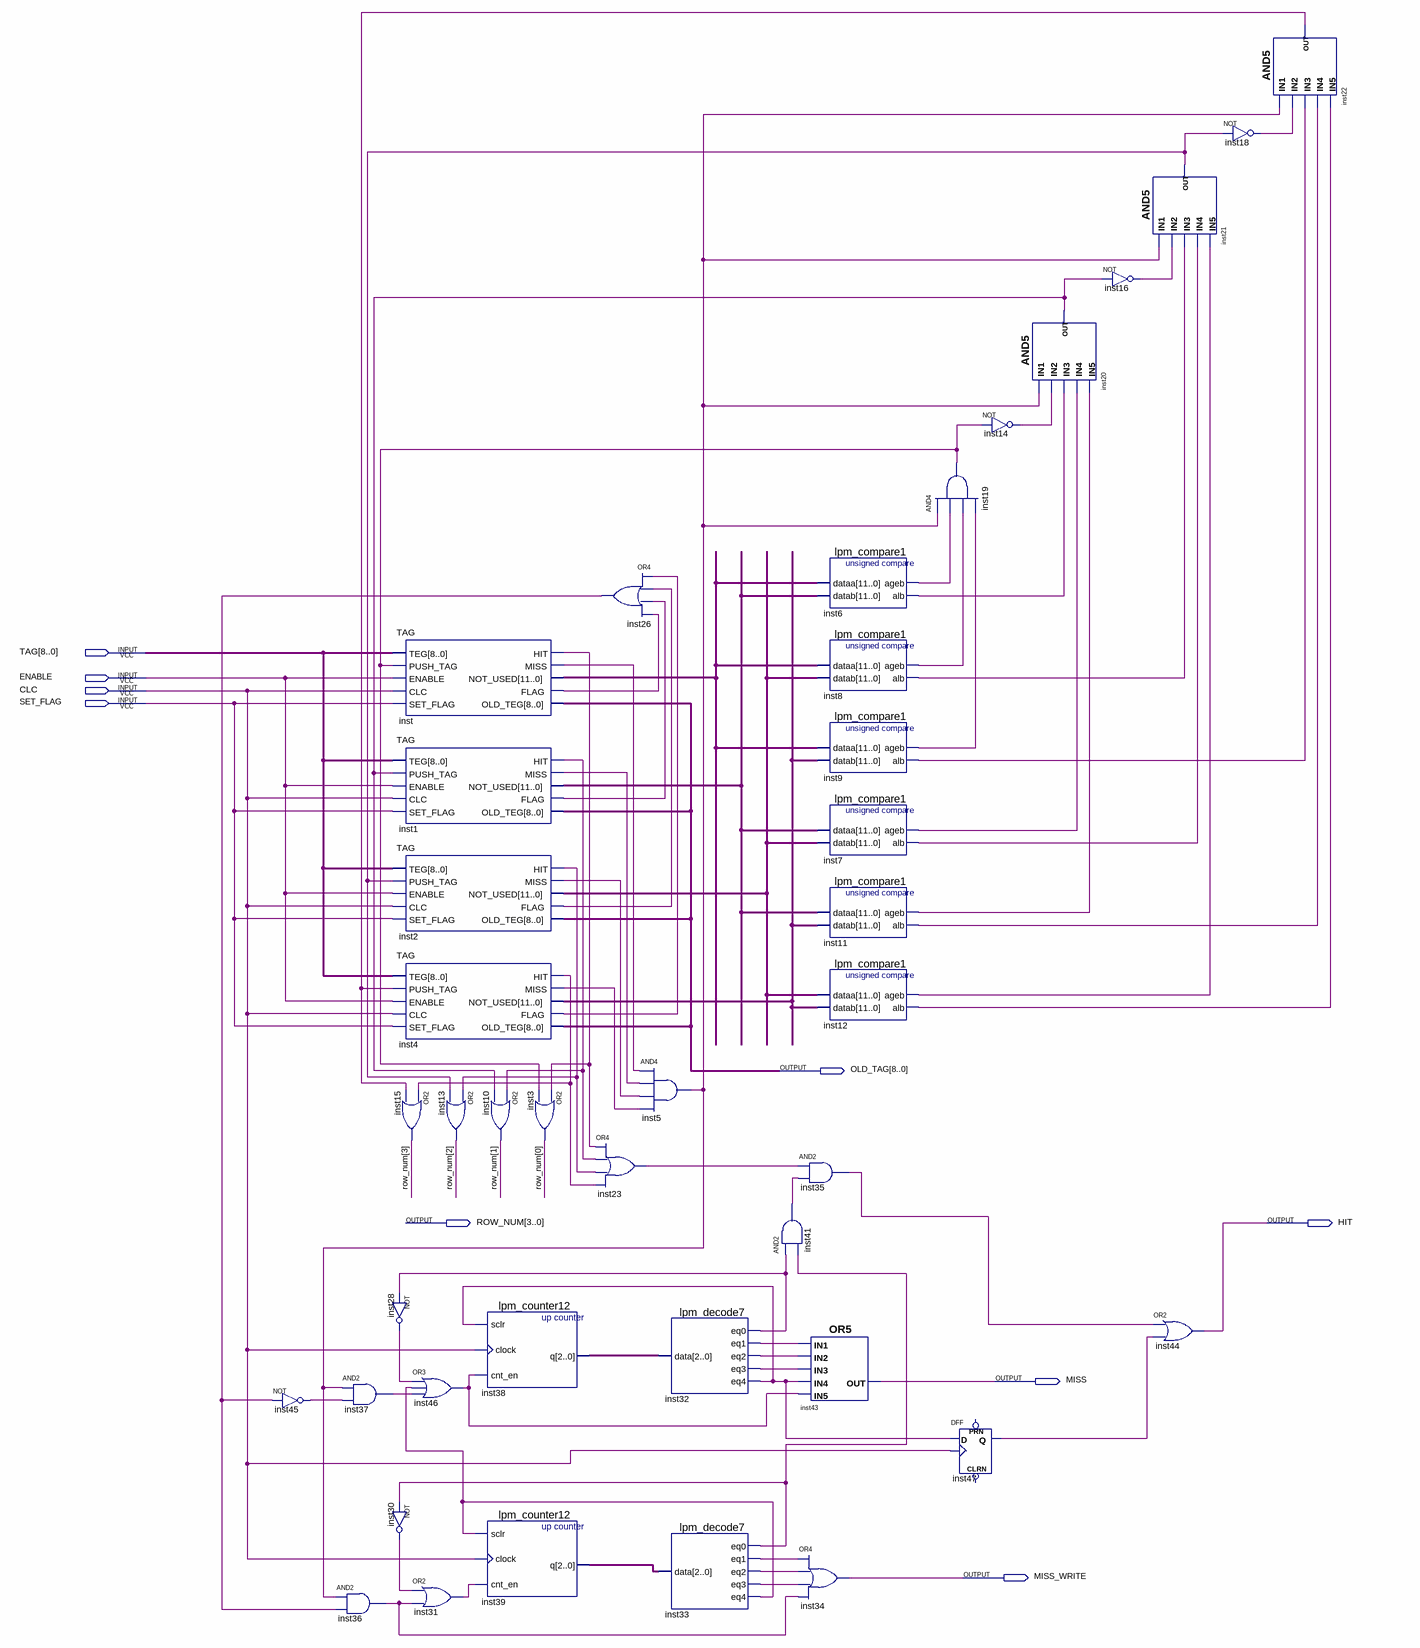
[diagram p0: schematic sheet]
// Quartus schematic TAG_MEM.bdf as structural Verilog: 41 symbols, 9 pins
module TAG_MEM (
  input  [8:0] TAG,
  input  ENABLE,
  input  CLC,
  input  SET_FLAG,
  output [8:0] OLD_TAG,
  output [3:0] ROW_NUM,
  output HIT,
  output MISS,
  output MISS_WRITE
);

  wire inst1_flag, inst1_hit, inst1_miss, inst2_flag, inst2_hit, inst2_miss, inst4_flag, inst4_hit,
       inst4_miss, inst5_out, inst6_ageb, inst6_alb, inst7_ageb, inst7_alb, inst8_ageb, inst8_alb,
       inst9_ageb, inst9_alb, inst11_ageb, inst11_alb, inst12_ageb, inst12_alb, inst14_out, inst16_out,
       inst18_out, inst19_out, inst20_out, inst21_out, inst22_out, inst23_out, inst26_out, inst28_out,
       inst30_out, inst31_out, inst32_eq0, inst32_eq1, inst32_eq2, inst32_eq3, inst32_eq4, inst33_eq0,
       inst33_eq1, inst33_eq2, inst33_eq3, inst33_eq4, inst35_out, inst36_out, inst37_out, inst41_out,
       inst45_out, inst46_out, inst47_q, inst_flag, inst_hit, inst_miss;
  wire [2:0] inst38_q, inst39_q;
  wire [11:0] inst1_not_used, inst2_not_used, inst4_not_used, inst_not_used;

  not inst45 (inst45_out, inst26_out);
  and inst37 (inst37_out, inst5_out, inst45_out);
  and inst36 (inst36_out, inst5_out, inst26_out);
  TAG inst (
    .TEG(TAG), .PUSH_TAG(inst19_out), .ENABLE(ENABLE), .CLC(CLC), .SET_FLAG(SET_FLAG), .HIT(inst_hit),
    .MISS(inst_miss), .NOT_USED(inst_not_used), .FLAG(inst_flag), .OLD_TEG(OLD_TAG));
  TAG inst1 (
    .TEG(TAG), .PUSH_TAG(inst20_out), .ENABLE(ENABLE), .CLC(CLC), .SET_FLAG(SET_FLAG), .HIT(inst1_hit),
    .MISS(inst1_miss), .NOT_USED(inst1_not_used), .FLAG(inst1_flag), .OLD_TEG(OLD_TAG));
  TAG inst2 (
    .TEG(TAG), .PUSH_TAG(inst21_out), .ENABLE(ENABLE), .CLC(CLC), .SET_FLAG(SET_FLAG), .HIT(inst2_hit),
    .MISS(inst2_miss), .NOT_USED(inst2_not_used), .FLAG(inst2_flag), .OLD_TEG(OLD_TAG));
  TAG inst4 (
    .TEG(TAG), .PUSH_TAG(inst22_out), .ENABLE(ENABLE), .CLC(CLC), .SET_FLAG(SET_FLAG), .HIT(inst4_hit),
    .MISS(inst4_miss), .NOT_USED(inst4_not_used), .FLAG(inst4_flag), .OLD_TEG(OLD_TAG));
  or inst15 (ROW_NUM[3], inst4_hit, inst22_out);
  not inst28 (inst28_out, inst32_eq0);
  not inst30 (inst30_out, inst33_eq0);
  or inst13 (ROW_NUM[2], inst2_hit, inst21_out);
  or inst46 (inst46_out, inst28_out, inst33_eq4, inst37_out);
  or inst31 (inst31_out, inst30_out, inst36_out);
  or inst10 (ROW_NUM[1], inst1_hit, inst20_out);
  lpm_counter12 inst38 (.sclr(inst32_eq4), .clock(CLC), .cnt_en(inst46_out), .q(inst38_q));
  lpm_counter12 inst39 (.sclr(inst33_eq4), .clock(CLC), .cnt_en(inst31_out), .q(inst39_q));
  or inst3 (ROW_NUM[0], inst_hit, inst19_out);
  or inst23 (inst23_out, inst_hit, inst1_hit, inst2_hit, inst4_hit);
  or inst26 (inst26_out, inst4_flag, inst2_flag, inst1_flag, inst_flag);
  and inst5 (inst5_out, inst_miss, inst1_miss, inst2_miss, inst4_miss);
  lpm_decode7 inst32 (
    .data(inst38_q), .eq0(inst32_eq0), .eq1(inst32_eq1), .eq2(inst32_eq2), .eq3(inst32_eq3), .eq4(inst32_eq4));
  lpm_decode7 inst33 (
    .data(inst39_q), .eq0(inst33_eq0), .eq1(inst33_eq1), .eq2(inst33_eq2), .eq3(inst33_eq3), .eq4(inst33_eq4));
  and inst35 (inst35_out, inst23_out, inst41_out);
  and inst41 (inst41_out, inst32_eq0, inst33_eq0);
  or inst43 (MISS, inst32_eq1, inst32_eq2, inst32_eq3, inst32_eq4, inst46_out);
  or inst34 (MISS_WRITE, inst33_eq1, inst33_eq2, inst33_eq3, inst36_out);
  lpm_compare1 inst6 (.dataa(inst_not_used), .datab(inst1_not_used), .ageb(inst6_ageb), .alb(inst6_alb));
  lpm_compare1 inst8 (.dataa(inst_not_used), .datab(inst2_not_used), .ageb(inst8_ageb), .alb(inst8_alb));
  lpm_compare1 inst9 (.dataa(inst_not_used), .datab(inst4_not_used), .ageb(inst9_ageb), .alb(inst9_alb));
  lpm_compare1 inst7 (.dataa(inst1_not_used), .datab(inst2_not_used), .ageb(inst7_ageb), .alb(inst7_alb));
  lpm_compare1 inst11 (.dataa(inst1_not_used), .datab(inst4_not_used), .ageb(inst11_ageb), .alb(inst11_alb));
  lpm_compare1 inst12 (.dataa(inst2_not_used), .datab(inst4_not_used), .ageb(inst12_ageb), .alb(inst12_alb));
  and inst19 (inst19_out, inst5_out, inst6_ageb, inst8_ageb, inst9_ageb);
  DFF inst47 (.CLK(CLC), .D(inst32_eq4), .Q(inst47_q));  // open: CLRN, PRN
  not inst14 (inst14_out, inst19_out);
  and inst20 (inst20_out, inst5_out, inst14_out, inst6_alb, inst7_ageb, inst11_ageb);
  not inst16 (inst16_out, inst20_out);
  and inst21 (inst21_out, inst5_out, inst16_out, inst8_alb, inst7_alb, inst12_ageb);
  or inst44 (HIT, inst35_out, inst47_q);
  not inst18 (inst18_out, inst21_out);
  and inst22 (inst22_out, inst5_out, inst18_out, inst9_alb, inst11_alb, inst12_alb);
endmodule
